# Altium schematic sheet 07 DDR PART2.SchDoc
size 420 x 297 mm
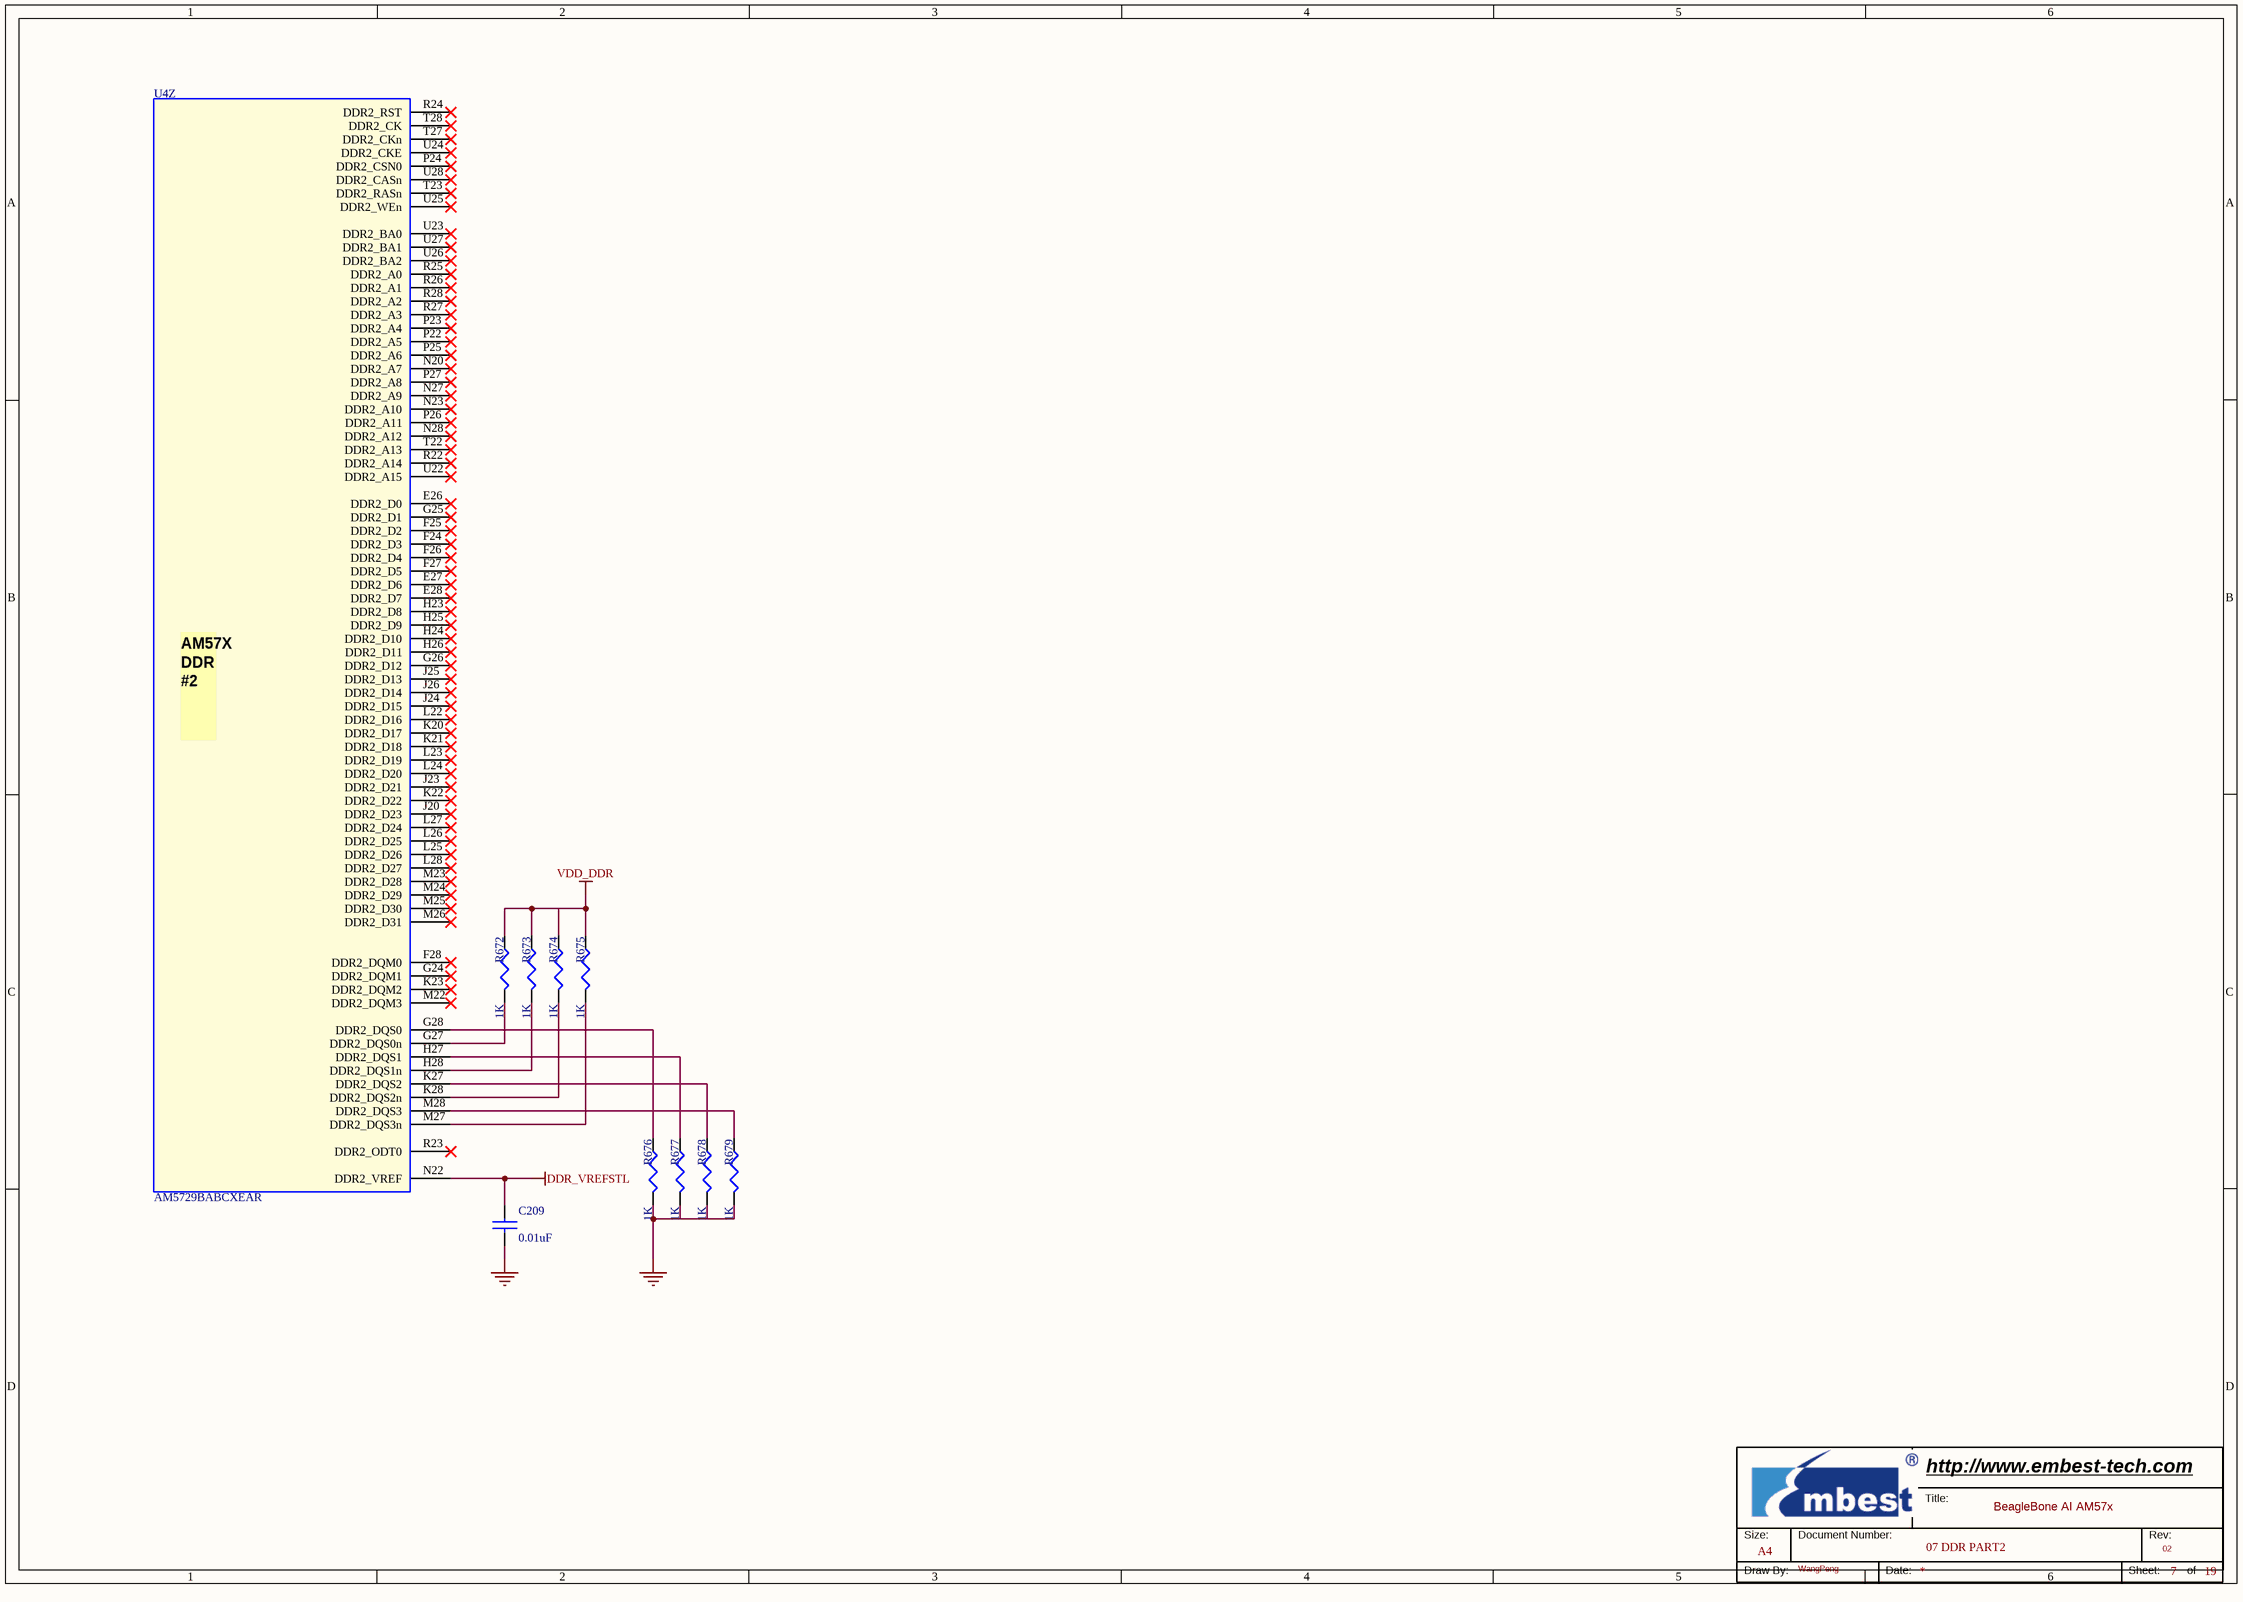
[diagram p0: 07 DDR PART2.SchDoc]

## Parts
*  Page Count: 19  Page Number: 7  Page Size: A4  Title: BeagleBone AI AM57x  RevCode: 02  Doc: 07 DDR PART2  Drawing: WangPeng  (hidden comment: Embest Title)  (graphical)
C209  0.01uF  [C0402]
R672  1K  [R0402]
R673  1K  [R0402]
R674  1K  [R0402]
R675  1K  [R0402]
R676  1K  [R0402]
R677  1K  [R0402]
R678  1K  [R0402]
R679  1K  [R0402]
U4  AM5729BABCXEAR  [BGA23X23-760-117M]  (part Z of 29)

## Nets
DDR_VREFSTL: C209.1 U4.N22(DDR2_VREF)
GND: C209.2 R676.2 R677.2 R678.2 R679.2
VDD_DDR: R672.1 R673.1 R674.1 R675.1
NetR672_2: R672.2 U4.G27(DDR2_DQS0n)
NetR673_2: R673.2 U4.H28(DDR2_DQS1n)
NetR674_2: R674.2 U4.K28(DDR2_DQS2n)
NetR675_2: R675.2 U4.M27(DDR2_DQS3n)
NetR676_1: R676.1 U4.G28(DDR2_DQS0)
NetR677_1: R677.1 U4.H27(DDR2_DQS1)
NetR678_1: R678.1 U4.K27(DDR2_DQS2)
NetR679_1: R679.1 U4.M28(DDR2_DQS3)

Not connected (* = marked no-connect by the designer): U4 E26(DDR2_D0)* E27(DDR2_D6)* E28(DDR2_D7)* F24(DDR2_D3)* F25(DDR2_D2)* F26(DDR2_D4)* F27(DDR2_D5)* F28(DDR2_DQM0)* G24(DDR2_DQM1)* G25(DDR2_D1)* G26(DDR2_D12)* H23(DDR2_D8)* H24(DDR2_D10)* H25(DDR2_D9)* H26(DDR2_D11)* J20(DDR2_D23)* J23(DDR2_D21)* J24(DDR2_D15)* J25(DDR2_D13)* J26(DDR2_D14)* K20(DDR2_D17)* K21(DDR2_D18)* K22(DDR2_D22)* K23(DDR2_DQM2)* L22(DDR2_D16)* L23(DDR2_D19)* L24(DDR2_D20)* L25(DDR2_D26)* L26(DDR2_D25)* L27(DDR2_D24)* L28(DDR2_D27)* M22(DDR2_DQM3)* M23(DDR2_D28)* M24(DDR2_D29)* M25(DDR2_D30)* M26(DDR2_D31)* N20(DDR2_A7)* N23(DDR2_A10)* N27(DDR2_A9)* N28(DDR2_A12)* P22(DDR2_A5)* P23(DDR2_A4)* P24(DDR2_CSN0)* P25(DDR2_A6)* P26(DDR2_A11)* P27(DDR2_A8)* R22(DDR2_A14)* R23(DDR2_ODT0)* R24(DDR2_RST)* R25(DDR2_A0)* R26(DDR2_A1)* R27(DDR2_A3)* R28(DDR2_A2)* T22(DDR2_A13)* T23(DDR2_RASn)* T27(DDR2_CKn)* T28(DDR2_CK)* U22(DDR2_A15)* U23(DDR2_BA0)* U24(DDR2_CKE)* U25(DDR2_WEn)* U26(DDR2_BA2)* U27(DDR2_BA1)* U28(DDR2_CASn)*

## Notes on the sheet
- (in symbol AM57X, part Z) AM57X DDR / #2 /
- (in symbol Embest Title) Title:; Size:; Document Number:; Rev:; Draw By:; Date:; Sheet:; of

## Library data of the parts
C209 = C: CAP,10NF,+/-10%,X7R,16V,SMD0402; Manufacturer: MURATA; Manufacturer Part Number: GRM155R71C103KA01D; Embest PN: 1004001100039; Part Type: Ceramic Capacitor
R672 R675 R676 R678 = R: RES,1K,+/-5%,1/16W,SMD0402; Manufacturer: YAGEO; Manufacturer Part Number: RC0402JR-071KL; Embest PN: 1003001100035; Part Type: Thick film Resistor
R673 R674 R677 R679 = R: RES,1K,+/-5%,1/16W,SMD0402; Manufacturer Part Number: RC0402JR-071KL; Manufacturer: YAGEO; Embest PN: 1003001100035; Part Type: Thick film Resistor
U4 = AM57X: IC ARM Dual Cortex-A15 Microprocessor FCBGA(ABC)-760 SMD JEDEC TRAY; Vendor: TI; Embest PN: 1002001100053; Status: BeagleBone AI; Manufacturer Part Number: AM5729BABCXEAR; Manufacturer: TI; Part Type: MPU
* = Embest Title: Page Create Date: May 29, 2006; WebSite: http://www.embest-tech.com; Company: Embest; Page Modify Date: *